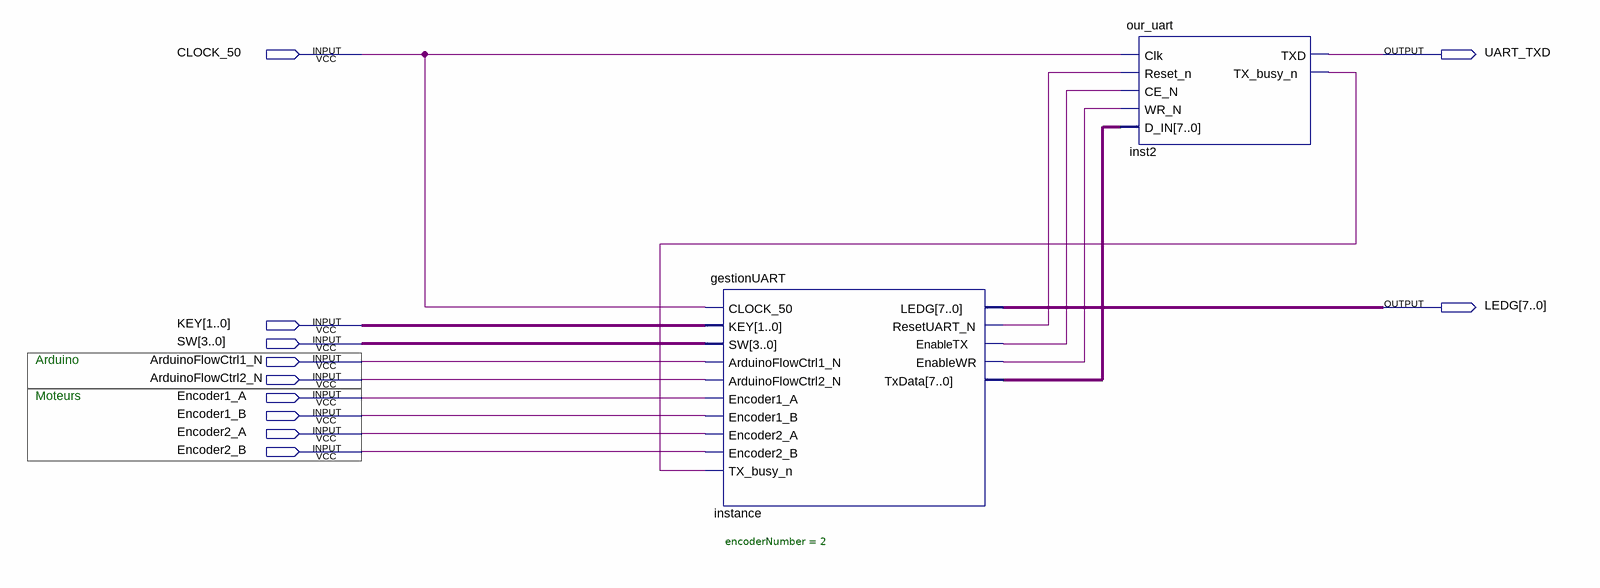
[diagram p0: schematic sheet]
// Quartus schematic ProjetEssai.bdf as structural Verilog: 2 symbols, 11 pins
module ProjetEssai (
  input  CLOCK_50,
  input  [1:0] KEY,
  input  [3:0] SW,
  input  ArduinoFlowCtrl1_N,
  input  ArduinoFlowCtrl2_N,
  input  Encoder1_A,
  input  Encoder1_B,
  input  Encoder2_A,
  input  Encoder2_B,
  output UART_TXD,
  output [7:0] LEDG
);

  wire inst2_tx_busy_n, instance_enabletx, instance_enablewr, instance_resetuart_n;
  wire [7:0] instance_txdata;

  gestionUART #(.encoderNumber(2)) \instance  (
    .CLOCK_50(CLOCK_50), .KEY(KEY), .SW(SW), .ArduinoFlowCtrl1_N(ArduinoFlowCtrl1_N),
    .ArduinoFlowCtrl2_N(ArduinoFlowCtrl2_N), .Encoder1_A(Encoder1_A), .Encoder1_B(Encoder1_B),
    .Encoder2_A(Encoder2_A), .Encoder2_B(Encoder2_B), .TX_busy_n(inst2_tx_busy_n), .LEDG(LEDG),
    .ResetUART_N(instance_resetuart_n), .EnableTX(instance_enabletx), .EnableWR(instance_enablewr),
    .TxData(instance_txdata));
  our_uart inst2 (
    .Clk(CLOCK_50), .Reset_n(instance_resetuart_n), .CE_N(instance_enabletx), .WR_N(instance_enablewr),
    .D_IN(instance_txdata), .TXD(UART_TXD), .TX_busy_n(inst2_tx_busy_n));

  // Notes on the sheet:
  //        Arduino
  //        Moteurs
endmodule
